# Altium project nRF52840_QI_Kernel.PrjPcb
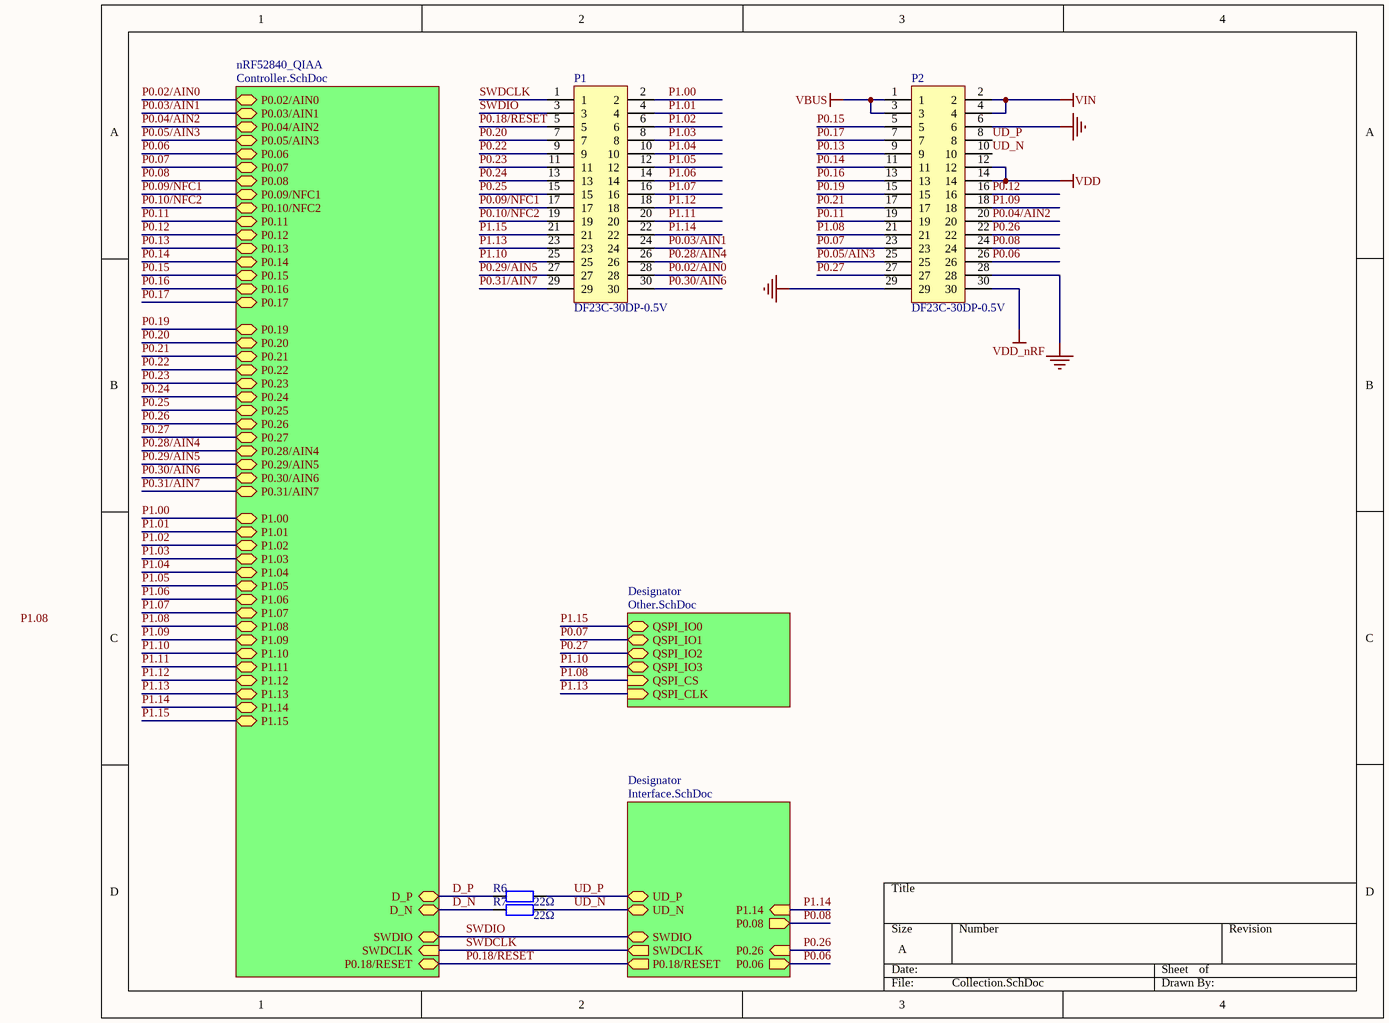
[diagram p0: Collection.SchDoc]
4 sheets, 79 parts. Net scope: hierarchical (ports join the sheet entries above them; power ports are global).
Board files: Main.PcbDoc, Main2.PcbDoc, Main4.PcbDoc
Sheets:
  Collection.SchDoc
    nRF52840_QIAA = Controller.SchDoc
    Designator = Interface.SchDoc
    Designator = Other.SchDoc

## Sheet Collection.SchDoc
size A; SheetNumber: 1; SheetTotal: 4

### Parts
P1  DF23C-30DP-0.5V  [DF23C-30DP-0.5V]
P2  DF23C-30DP-0.5V  [DF23C-30DP-0.5V]
R6  value 22Ω  [0402_R]  (hidden comment: 22Ω (22R0) ±1%)
R7  value 22Ω  [0402_R]  (hidden comment: 22Ω (22R0) ±1%)

### Sub-sheets
Designator = Interface.SchDoc: UD_P (bidir), UD_N (bidir), SWDCLK (out), SWDIO (bidir), P0.06 (out), P0.26 (in), P1.14 (in), P0.08 (out), P0.18/RESET (out)
Designator = Other.SchDoc: QSPI_IO0 (bidir), QSPI_IO1 (bidir), QSPI_IO2 (bidir), QSPI_IO3 (bidir), QSPI_CS (in), QSPI_CLK (in)
nRF52840_QIAA = Controller.SchDoc: P0.02/AIN0 (bidir), P0.03/AIN1 (bidir), P0.04/AIN2 (bidir), P0.05/AIN3 (bidir), P0.06 (bidir), P0.07 (bidir), P0.08 (bidir), D_P (bidir), D_N (bidir), P0.11 (bidir), P0.12 (bidir), P0.13 (bidir), P0.14 (bidir), P0.15 (bidir), P0.16 (bidir), P0.17 (bidir), P0.18/RESET (bidir), P0.19 (bidir), P0.20 (bidir), P0.21 (bidir), P0.22 (bidir), P0.23 (bidir), P0.24 (bidir), P0.25 (bidir), P0.26 (bidir), P0.27 (bidir), P0.28/AIN4 (bidir), P0.29/AIN5 (bidir), P0.30/AIN6 (bidir), P0.31/AIN7 (bidir), P1.00 (bidir), P1.01 (bidir), P1.02 (bidir), P1.03 (bidir), P1.04 (bidir), P1.05 (bidir), P1.06 (bidir), P1.07 (bidir), P1.08 (bidir), P1.09 (bidir), P1.10 (bidir), P1.11 (bidir), P1.12 (bidir), P1.13 (bidir), P1.14 (bidir), P1.15 (bidir), SWDCLK (in), SWDIO (bidir), P0.10/NFC2 (bidir), P0.09/NFC1 (bidir)

### Nets
GND: P2.6 P2.28 P2.29
VBUS: P2.1 P2.3
VDD: P2.12 P2.14
VDD_nRF: P2.30
VIN: P2.2 P2.4
D_N: R7.1 ; sheet nRF52840_QIAA/D_N
D_P: R6.1 ; sheet nRF52840_QIAA/D_P
P0.02/AIN0: P1.28 ; sheet nRF52840_QIAA/P0.02/AIN0
P0.03/AIN1: P1.24 ; sheet nRF52840_QIAA/P0.03/AIN1
P0.04/AIN2: P2.20 ; sheet nRF52840_QIAA/P0.04/AIN2
P0.05/AIN3: P2.25 ; sheet nRF52840_QIAA/P0.05/AIN3
P0.06: P2.26 ; sheet nRF52840_QIAA/P0.06, sheet Designator/P0.06
P0.07: P2.23 ; sheet nRF52840_QIAA/P0.07, sheet Designator/QSPI_IO1
P0.08: P2.24 ; sheet nRF52840_QIAA/P0.08, sheet Designator/P0.08
P0.09/NFC1: P1.17 ; sheet nRF52840_QIAA/P0.09/NFC1
P0.10/NFC2: P1.19 ; sheet nRF52840_QIAA/P0.10/NFC2
P0.11: P2.19 ; sheet nRF52840_QIAA/P0.11
P0.12: P2.16 ; sheet nRF52840_QIAA/P0.12
P0.13: P2.9 ; sheet nRF52840_QIAA/P0.13
P0.14: P2.11 ; sheet nRF52840_QIAA/P0.14
P0.15: P2.5 ; sheet nRF52840_QIAA/P0.15
P0.16: P2.13 ; sheet nRF52840_QIAA/P0.16
P0.17: P2.7 ; sheet nRF52840_QIAA/P0.17
P0.18/RESET: P1.5 ; sheet nRF52840_QIAA/P0.18/RESET, sheet Designator/P0.18/RESET
P0.19: P2.15 ; sheet nRF52840_QIAA/P0.19
P0.20: P1.7 ; sheet nRF52840_QIAA/P0.20
P0.21: P2.17 ; sheet nRF52840_QIAA/P0.21
P0.22: P1.9 ; sheet nRF52840_QIAA/P0.22
P0.23: P1.11 ; sheet nRF52840_QIAA/P0.23
P0.24: P1.13 ; sheet nRF52840_QIAA/P0.24
P0.25: P1.15 ; sheet nRF52840_QIAA/P0.25
P0.26: P2.22 ; sheet nRF52840_QIAA/P0.26, sheet Designator/P0.26
P0.27: P2.27 ; sheet nRF52840_QIAA/P0.27, sheet Designator/QSPI_IO2
P0.28/AIN4: P1.26 ; sheet nRF52840_QIAA/P0.28/AIN4
P0.29/AIN5: P1.27 ; sheet nRF52840_QIAA/P0.29/AIN5
P0.30/AIN6: P1.30 ; sheet nRF52840_QIAA/P0.30/AIN6
P0.31/AIN7: P1.29 ; sheet nRF52840_QIAA/P0.31/AIN7
P1.00: P1.2 ; sheet nRF52840_QIAA/P1.00
P1.01: P1.4 ; sheet nRF52840_QIAA/P1.01
P1.02: P1.6 ; sheet nRF52840_QIAA/P1.02
P1.03: P1.8 ; sheet nRF52840_QIAA/P1.03
P1.04: P1.10 ; sheet nRF52840_QIAA/P1.04
P1.05: P1.12 ; sheet nRF52840_QIAA/P1.05
P1.06: P1.14 ; sheet nRF52840_QIAA/P1.06
P1.07: P1.16 ; sheet nRF52840_QIAA/P1.07
P1.08: P2.21 ; sheet nRF52840_QIAA/P1.08, sheet Designator/QSPI_CS
P1.09: P2.18 ; sheet nRF52840_QIAA/P1.09
P1.10: P1.25 ; sheet nRF52840_QIAA/P1.10, sheet Designator/QSPI_IO3
P1.11: P1.20 ; sheet nRF52840_QIAA/P1.11
P1.12: P1.18 ; sheet nRF52840_QIAA/P1.12
P1.13: P1.23 ; sheet nRF52840_QIAA/P1.13, sheet Designator/QSPI_CLK
P1.14: P1.22 ; sheet nRF52840_QIAA/P1.14, sheet Designator/P1.14
P1.15: P1.21 ; sheet nRF52840_QIAA/P1.15, sheet Designator/QSPI_IO0
SWDCLK: P1.1 ; sheet nRF52840_QIAA/SWDCLK, sheet Designator/SWDCLK
SWDIO: P1.3 ; sheet nRF52840_QIAA/SWDIO, sheet Designator/SWDIO
UD_N: P2.10 R7.2 ; sheet Designator/UD_N
UD_P: P2.8 R6.2 ; sheet Designator/UD_P

### Notes on the sheet
- Labels drawn without touching a wire or pin: P1.08

### Library data of the parts
R6 R7 = 0402 22Ω (22R0) 1%: Chip Resistor

## Sheet Controller.SchDoc
size A; SheetNumber: 2; SheetTotal: 4
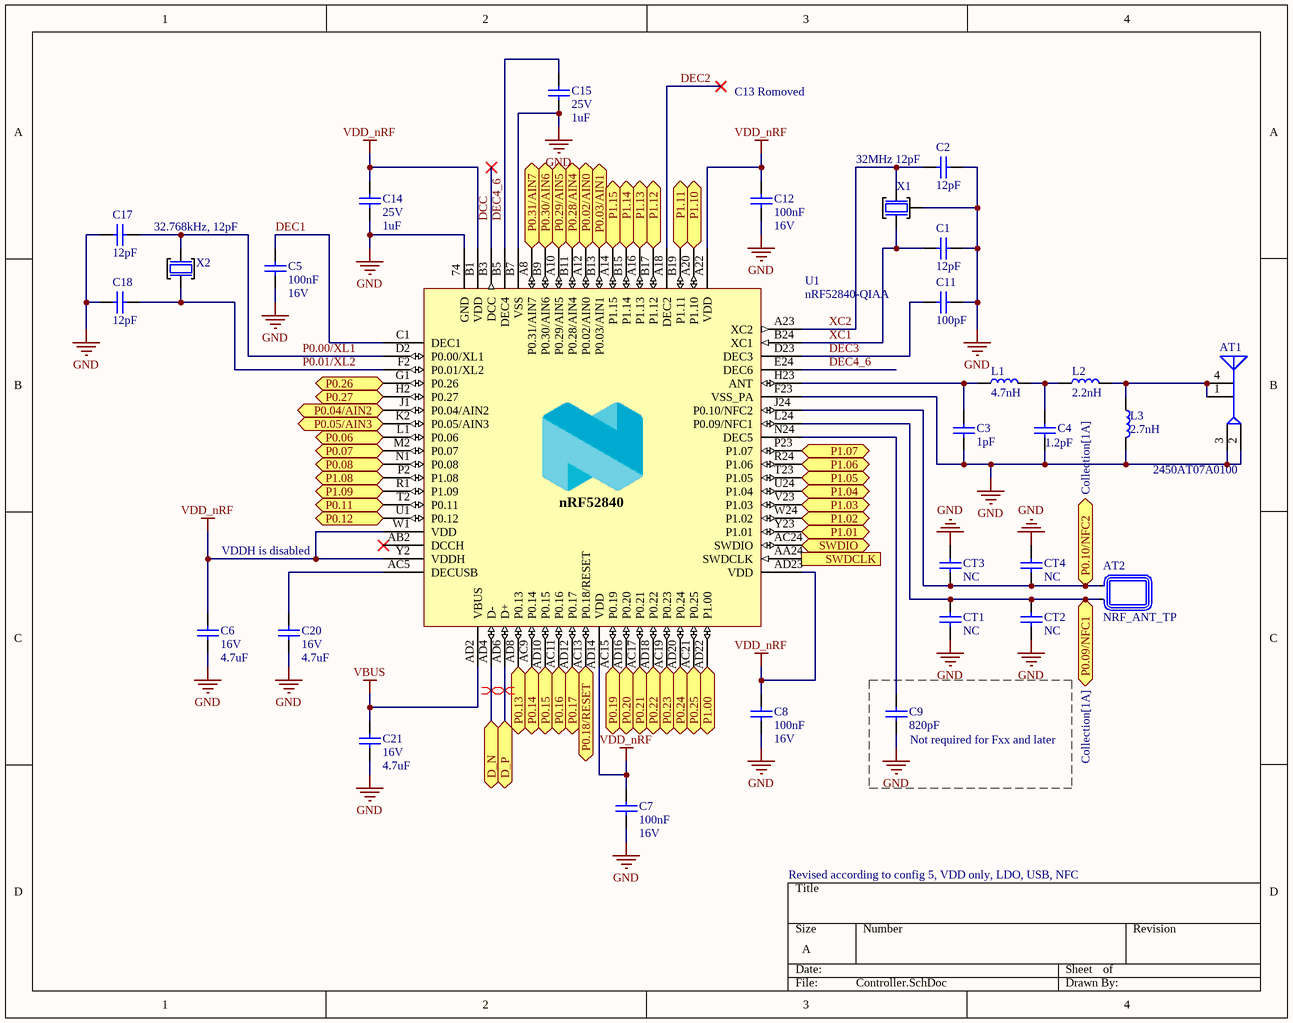
[diagram p1: Controller.SchDoc]

### Parts
AT1  2450AT07A0100  [2450AT07A0100-Footprint-1]
AT2  NRF_ANT_TP  [NRF_ANT_TP-Footprint-1]
C1  value 12pF  [0402_C]  (hidden comment: 12pF (120) 5% 50V)
C2  value 12pF  [0402_C]  (hidden comment: 12pF (120) 5% 50V)
C3  value 1pF  [0402_C]  (hidden comment: 1pF (1R0) 0.25pF 50V)
C4  value 1.2pF  [0402_C]  (hidden comment: 1.2pF (1R2) 50V)
C5  value 100nF  Voltage: 16V  [0402_C]  (hidden comment: 100nF (104) 10% 16V)
C6  value 4.7uF  Voltage: 16V  [0603_C]  (hidden comment: 4.7uF (475) 10% 16V)
C7  value 100nF  Voltage: 16V  [0402_C]  (hidden comment: 100nF (104) 10% 16V)
C8  value 100nF  Voltage: 16V  [0402_C]  (hidden comment: 100nF (104) 10% 16V)
C9  value 820pF  [0402_C]  (hidden comment: 820pF (821) 10% 50V)
C11  value 100pF  [0402_C]  (hidden comment: 100pF (101) 5% 50V)
C12  value 100nF  Voltage: 16V  [0402_C]  (hidden comment: 100nF (104) 10% 16V)
C14  value 1uF  Voltage: 25V  [0402_C]  (hidden comment: 1uF (105) 10% 25V)
C15  value 1uF  Voltage: 25V  [0402_C]  (hidden comment: 1uF (105) 10% 25V)
C17  value 12pF  [0402_C]  (hidden comment: 12pF (120) 5% 50V)
C18  value 12pF  [0402_C]  (hidden comment: 12pF (120) 5% 50V)
C20  value 4.7uF  Voltage: 16V  [0603_C]  (hidden comment: 4.7uF (475) 10% 16V)
C21  value 4.7uF  Voltage: 16V  [0603_C]  (hidden comment: 4.7uF (475) 10% 16V)
CT1  NC  [0402_C]
CT2  NC  [0402_C]
CT3  NC  [0402_C]
CT4  NC  [0402_C]
L1  4.7nH  [0402_L]
L2  2.2nH  [0402_L]
L3  2.7nH  [0402_L]
U1  nRF52840-QIAA  [AQFN50P700X700X85_HS-74N]
X1  32MHz 12pF  [XTAL_2016_4P]
X2  32.768kHz, 12pF  [XTAL_2012_2P]

### Blocks framed on the sheet
Not required for Fxx and later: C9

### Ports
D_N (bidir, see Collection[2D]), D_P (bidir, see Collection[2D]), P0.02/AIN0 (bidir, see Collection[1A]), P0.03/AIN1 (bidir, see Collection[1A]), P0.04/AIN2 (bidir, see Collection[1A]), P0.05/AIN3 (bidir, see Collection[1A]), P0.06 (bidir, see Collection[1A], Interface[4C]), P0.07 (bidir, see Collection[1A]), P0.08 (bidir, see Collection[1A], Interface[2C]), P0.09/NFC1 (bidir, see Collection[1A]), P0.10/NFC2 (bidir, see Collection[1A]), P0.11 (bidir, see Collection[1A]), P0.12 (bidir, see Collection[1A]), P0.13 (bidir, see Collection[1A]), P0.14 (bidir, see Collection[1B]), P0.15 (bidir, see Collection[1B]), P0.16 (bidir, see Collection[1B]), P0.17 (bidir, see Collection[1B]), P0.18/RESET (bidir, see Collection[2D], Interface[1D]), P0.19 (bidir, see Collection[1B]), P0.20 (bidir, see Collection[1B]), P0.21 (bidir, see Collection[1B]), P0.22 (bidir, see Collection[1B]), P0.23 (bidir, see Collection[1B]), P0.24 (bidir, see Collection[1B]), P0.25 (bidir, see Collection[1B]), P0.26 (bidir, see Collection[1B], Interface[4C]), P0.27 (bidir, see Collection[1B]), P0.28/AIN4 (bidir, see Collection[1B]), P0.29/AIN5 (bidir, see Collection[1B]), P0.30/AIN6 (bidir, see Collection[1B]), P0.31/AIN7 (bidir, see Collection[1B]), P1.00 (bidir, see Collection[1C]), P1.01 (bidir, see Collection[1C]), P1.02 (bidir, see Collection[1C]), P1.03 (bidir, see Collection[1C]), P1.04 (bidir, see Collection[1C]), P1.05 (bidir, see Collection[1C]), P1.06 (bidir, see Collection[1C]), P1.07 (bidir, see Collection[1C]), P1.08 (bidir, see Collection[1C]), P1.09 (bidir, see Collection[1C]), P1.10 (bidir, see Collection[1C]), P1.11 (bidir, see Collection[1C]), P1.12 (bidir, see Collection[1C]), P1.13 (bidir, see Collection[1C]), P1.14 (bidir, see Collection[1C], Interface[2D]), P1.15 (bidir, see Collection[1C]), SWDCLK (in, see Collection[2D], Interface[4C]), SWDIO (bidir, see Collection[2D], Interface[4C])

### Nets
GND: AT1.2 AT1.3 C1.2 C2.2 C3.1 C4.1 C5.1 C6.1 C7.1 C8.1 C9.1 C11.2 C12.1 C14.1 C15.1 C17.1 C18.1 C20.1 C21.1 CT1.1 CT2.1 CT3.2 CT4.2 L3.2 U1.74(GND) U1.B7(VSS) U1.F23(VSS_PA) X1.2(GND)
VBUS: C21.2 U1.AD2(VBUS)
VDD_nRF: C6.2 C7.2 C8.2 C12.2 C14.2 U1.A22(VDD) U1.AD14(VDD) U1.AD23(VDD) U1.B1(VDD) U1.W1(VDD) U1.Y2(VDDH)
D_N: U1.AD4(D-) ; port D_N
D_P: U1.AD6(D+) ; port D_P
DCC: U1.B3(DCC)
DEC1: C5.2 U1.C1(DEC1)
DEC2: U1.A18(DEC2)
DEC3: C11.1 U1.D23(DEC3)
DEC4_6: C15.2 U1.B5(DEC4) U1.E24(DEC6)
P0.00/XL1: C17.2 U1.D2(P0.00/XL1) X2.2(OUT)
P0.01/XL2: C18.2 U1.F2(P0.01/XL2) X2.1(IN)
P0.02/AIN0: U1.A12(P0.02/AIN0) ; port P0.02/AIN0
P0.03/AIN1: U1.B13(P0.03/AIN1) ; port P0.03/AIN1
P0.04/AIN2: U1.J1(P0.04/AIN2) ; port P0.04/AIN2
P0.05/AIN3: U1.K2(P0.05/AIN3) ; port P0.05/AIN3
P0.06: U1.L1(P0.06) ; port P0.06
P0.07: U1.M2(P0.07) ; port P0.07
P0.08: U1.N1(P0.08) ; port P0.08
P0.09/NFC1: AT2.2 CT1.2 CT2.2 U1.L24(P0.09/NFC1) ; port P0.09/NFC1
P0.10/NFC2: AT2.1 CT3.1 CT4.1 U1.J24(P0.10/NFC2) ; port P0.10/NFC2
P0.11: U1.T2(P0.11) ; port P0.11
P0.12: U1.U1(P0.12) ; port P0.12
P0.13: U1.AD8(P0.13) ; port P0.13
P0.14: U1.AC9(P0.14) ; port P0.14
P0.15: U1.AD10(P0.15) ; port P0.15
P0.16: U1.AC11(P0.16) ; port P0.16
P0.17: U1.AD12(P0.17) ; port P0.17
P0.18/RESET: U1.AC13(P0.18/RESET) ; port P0.18/RESET
P0.19: U1.AC15(P0.19) ; port P0.19
P0.20: U1.AD16(P0.20) ; port P0.20
P0.21: U1.AC17(P0.21) ; port P0.21
P0.22: U1.AD18(P0.22) ; port P0.22
P0.23: U1.AC19(P0.23) ; port P0.23
P0.24: U1.AD20(P0.24) ; port P0.24
P0.25: U1.AC21(P0.25) ; port P0.25
P0.26: U1.G1(P0.26) ; port P0.26
P0.27: U1.H2(P0.27) ; port P0.27
P0.28/AIN4: U1.B11(P0.28/AIN4) ; port P0.28/AIN4
P0.29/AIN5: U1.A10(P0.29/AIN5) ; port P0.29/AIN5
P0.30/AIN6: U1.B9(P0.30/AIN6) ; port P0.30/AIN6
P0.31/AIN7: U1.A8(P0.31/AIN7) ; port P0.31/AIN7
P1.00: U1.AD22(P1.00) ; port P1.00
P1.01: U1.Y23(P1.01) ; port P1.01
P1.02: U1.W24(P1.02) ; port P1.02
P1.03: U1.V23(P1.03) ; port P1.03
P1.04: U1.U24(P1.04) ; port P1.04
P1.05: U1.T23(P1.05) ; port P1.05
P1.06: U1.R24(P1.06) ; port P1.06
P1.07: U1.P23(P1.07) ; port P1.07
P1.08: U1.P2(P1.08) ; port P1.08
P1.09: U1.R1(P1.09) ; port P1.09
P1.10: U1.A20(P1.10) ; port P1.10
P1.11: U1.B19(P1.11) ; port P1.11
P1.12: U1.B17(P1.12) ; port P1.12
P1.13: U1.A16(P1.13) ; port P1.13
P1.14: U1.B15(P1.14) ; port P1.14
P1.15: U1.A14(P1.15) ; port P1.15
SWDCLK: U1.AA24(SWDCLK) ; port SWDCLK
SWDIO: U1.AC24(SWDIO) ; port SWDIO
XC1: C1.1 U1.B24(XC1) X1.1(IN)
XC2: C2.1 U1.A23(XC2) X1.3(OUT)
NetAT1_1: AT1.1 AT1.4 L2.2 L3.1
NetC3_2: C3.2 L1.1 U1.H23(ANT)
NetC4_2: C4.2 L1.2 L2.1
NetC9_2: C9.2 U1.N24(DEC5)
NetC20_2: C20.2 U1.AC5(DECUSB)

Not connected (* = marked no-connect by the designer): U1 AB2(DCCH)*

### Layout directives
differential pair: D_N, D_P

### Notes on the sheet
- C13 Romoved
- VDDH is disabled
- Revised according to config 5, VDD only, LDO, USB, NFC
- (in symbol nRF52840-QIAA) nRF52840

### Library data of the parts
AT1 = CMP-00025-00003-1: 2.4GHz Chip RF Antenna 2.4GHz ~ 2.5GHz 1dBi Solder Surface Mount; Impedance: 50Ω; Max Operating Temperature: 125°C; Frequency: 2.4GHz; Pins: 4; RoHS Compliant: Yes; Min Operating Temperature: -40°C; Mounting Technology: SMD
AT2 = CMP-00025-00004-1: NRF Antenna Testpoint; Pins: 2
C1 C2 C17 C18 = 0402 12pF (120) 5% 50V: Chip Capacitor; Package: 0402; Voltage: 50V
C3 = 0402 1pF (1R0) 0.25pF 50V: Chip Capacitor; Voltage: 50V
C4 = 0402 1.2pF (1R2) 50V: Chip Capacitor; Voltage: 50V
C5 C7 C8 C12 = 0402 100nF (104) 10% 16V: Chip Capacitor
C6 C20 C21 = 0603 4.7uF (475) 10% 16V: Chip Capacitor; ComponentLink1Description: 供应商链接; ComponentLink1URL: http://www.szlcsc.com/product/details_20375.html; Package: 0603
C9 = 0402 820pF (821) 10% 50V: Chip Capacitor; Voltage: 50V
C11 = 0402 100pF (101) 5% 50V: Chip Capacitor; Voltage: 50V
C14 C15 = 0402 1uF (105) 10% 25V: Chip Capacitor
CT1-CT4 = 0402 Capacitor Testpoint: Chip Capacitor Testpoint; Value: NC
L1 = 0402 4.7nH 0.3nH: Chip Inductor; ComponentLink1Description: 供应商链接; ComponentLink1URL: http://www.szlcsc.com/product/details_14246.html; Value: 4.7nH
L2 = 0402 2.2nH: Chip Inductor; Value: 2.2nH
L3 = 0402 2.7nH 0.3nH: Chip Inductor; Value: 2.7nH
U1 = nRF52840-QIAA: Multi-protocol Bluetooth Low Energy, IEEE 802.15.4, ANT and 2.4GHz proprietary system-on-chip; Pad Count: 73; Part Number: nRF52840-QIAA; LatestRevisionDate: 2017-08-21; Published: 2017-08-21; Value: nRF52840-QIAA; Footprint Doc: AQFN-73
X1 = XTAL_SMD2016_32MHz_12pF: XTAL SMD 2016, 32MHz, Cl=12pF, Total Tol: ±20ppm; Frequency: 32MHz; Pins: 4
X2 = XTAL_SMD2012_32.768kHz_12pF: 32.768kHz 12pF ±20ppm SMD2012-2P  Crystals ROHS; Pad Count: 2; Frequency: 32.768kHz; Component Class: Oscillators

## Sheet Interface.SchDoc
size A; SheetNumber: 3; SheetTotal: 4
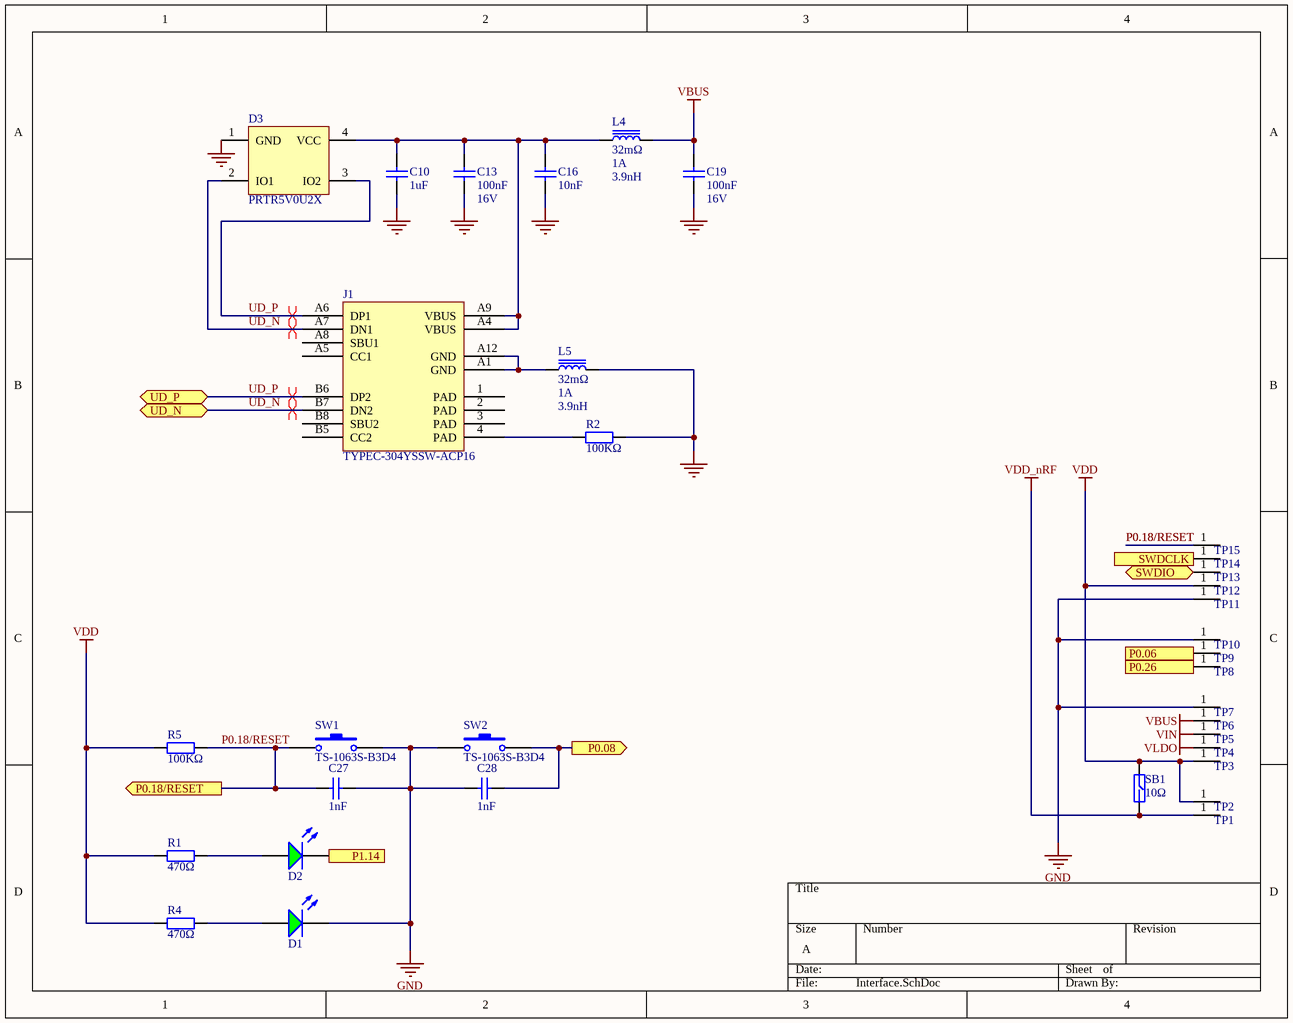
[diagram p2: Interface.SchDoc]

### Parts
C10  value 1uF  [0603_C]  (hidden comment: 1uF (105) 10% 50V)
C13  value 100nF  Voltage: 16V  [0402_C]  (hidden comment: 100nF (104) 10% 16V)
C16  value 10nF  [0402_C]  (hidden comment: 10nF (103) 10% 50V)
C19  value 100nF  Voltage: 16V  [0402_C]  (hidden comment: 100nF (104) 10% 16V)
C27  value 1nF  [0402_C]  (hidden comment: 1nF (102) 10% 50V)
C28  value 1nF  [0402_C]  (hidden comment: 1nF (102) 10% 50V)
D1  0603 LED Green  [0603_LED_S1]  (value not drawn)
D2  0603 LED Green  [0603_LED_S1]  (value not drawn)
D3  PRTR5V0U2X  [SOT190P230X110-4L]
J1  TYPEC-304YSSW-ACP16  [TYPEC-304YSSW-ACP16]
L4  value 3.9nH  DC Resistance: 32mΩ  Current: 1A  [0603_L]  (hidden comment: LQW18AN3N9C10D)
L5  value 3.9nH  DC Resistance: 32mΩ  Current: 1A  [0603_L]  (hidden comment: LQW18AN3N9C10D)
R1  value 470Ω  [0402_R]  (hidden comment: 470Ω (4700) ±1%)
R2  value 100KΩ  [0402_R]  (hidden comment: 100KΩ (1003) ±1%)
R4  value 470Ω  [0402_R]  (hidden comment: 470Ω (4700) ±1%)
R5  value 100KΩ  [0402_R]  (hidden comment: 100KΩ (1003) ±1%)
SB1  10Ω  [0603-FUSE]
SW1  TS-1063S-B3D4  [TS-1063S-B3D4]
SW2  TS-1063S-B3D4  [TS-1063S-B3D4]
TP1  Test Point  [TP_H_24_80_36]  (value not drawn)  (net tie, no BOM)
TP2  Test Point  [TP_H_24_80_36]  (value not drawn)  (net tie, no BOM)
TP3  Test Point  [TP_H_24_80_36]  (value not drawn)  (net tie, no BOM)
TP4  Test Point  [TP_H_24_80_36]  (value not drawn)  (net tie, no BOM)
TP5  Test Point  [TP_H_24_80_36]  (value not drawn)  (net tie, no BOM)
TP6  Test Point  [TP_H_24_80_36]  (value not drawn)  (net tie, no BOM)
TP7  Test Point  [TP_H_24_80_36]  (value not drawn)  (net tie, no BOM)
TP8  Test Point  [TP_H_24_80_36]  (value not drawn)  (net tie, no BOM)
TP9  Test Point  [TP_H_24_80_36]  (value not drawn)  (net tie, no BOM)
TP10  Test Point  [TP_H_24_80_36]  (value not drawn)  (net tie, no BOM)
TP11  Test Point  [TP_H_24_80_36]  (value not drawn)  (net tie, no BOM)
TP12  Test Point  [TP_H_24_80_36]  (value not drawn)  (net tie, no BOM)
TP13  Test Point  [TP_H_24_80_36]  (value not drawn)  (net tie, no BOM)
TP14  Test Point  [TP_H_24_80_36]  (value not drawn)  (net tie, no BOM)
TP15  Test Point  [TP_H_24_80_36]  (value not drawn)  (net tie, no BOM)

### Ports
P0.06 (out, see Collection[3D], Controller[1B]), P0.08 (out, see Collection[3D], Controller[1B]), P0.18/RESET (out, see Collection[2D], Controller[2C]), P0.26 (in, see Collection[3D], Controller[1B]), P1.14 (in, see Collection[3D], Controller[2A]), SWDCLK (out, see Collection[2D], Controller[3C]), SWDIO (bidir, see Collection[2D], Controller[3C]), UD_N (bidir, see Collection[2D]), UD_P (bidir, see Collection[2D])

### Nets
GND: C10.1 C13.1 C16.1 C19.1 C27.2 C28.1 D1.K D3.1(GND) L5.2 R2.2 SW1.2 SW2.1 TP7.1(TP) TP10.1(TP) TP11.1(TP)
VBUS: C19.2 L4.2 TP6.1(TP)
VDD: R1.1 R4.1 R5.1 SB1.1 TP2.1(TP) TP3.1(TP) TP12.1(TP)
VDD_nRF: SB1.2 TP1.1(TP)
VIN: TP5.1(TP)
VLDO: TP4.1(TP)
P0.06: TP9.1(TP) ; port P0.06
P0.08: C28.2 SW2.2 ; port P0.08
P0.18/RESET: C27.1 R5.2 SW1.1 TP15.1(TP) ; port P0.18/RESET
P0.26: TP8.1(TP) ; port P0.26
P1.14: D2.K ; port P1.14
SWDCLK: TP14.1(TP) ; port SWDCLK
SWDIO: TP13.1(TP) ; port SWDIO
UD_N: D3.2(IO1) J1.A7(DN1) J1.B7(DN2) ; port UD_N
UD_P: D3.3(IO2) J1.A6(DP1) J1.B6(DP2) ; port UD_P
NetC10_2: C10.2 C13.2 C16.2 D3.4(VCC) J1.A4(VBUS) J1.A9(VBUS) L4.1
NetD1_A: D1.A R4.2
NetD2_A: D2.A R1.2
NetJ1_4: J1.4(PAD) R2.1
NetJ1_A1: J1.A1(GND) J1.A12(GND) L5.1

Not connected (* = marked no-connect by the designer): J1 1(PAD) 2(PAD) 3(PAD) A5(CC1) A8(SBU1) B5(CC2) B8(SBU2)

### Layout directives
differential pair: UD_N, UD_P

### Library data of the parts
C10 = 0603 1uF (105) 10% 50V: Chip Capacitor; Package: 0603; Voltage: 50V
C13 C19 = 0402 100nF (104) 10% 16V: Chip Capacitor
C16 = 0402 10nF (103) 10% 50V: Chip Capacitor; Package: 0402; Voltage: 50V
C27 C28 = 0402 1nF (102) 10% 50V: Chip Capacitor; Voltage: 50V
D1 D2 = 0603 LED Green: Green LED; Package: 0603; Color: Green
D3 = PRTR5V0U2X: Ultra low capacitance double rail-to-rail ESD protection diode; Manufacturer: NXP Semiconductors; Part number IPS: 00000009951; Note: N.A.; Artikkelnr Noca: 10069015; Pad Count: 4; Part Number: PRTR5V0U2X; Manufacturer Part Number: PRTR5V0U2X; LatestRevisionDate: 2017-11-09; Publisher: Nordic Semiconductor; Published: 2012-06-11; Value: PRTR5V0U2X; Footprint Doc: SOT-143B; ComponentLink1URL: N.A.; ComponentLink1Description: Datasheet; ComponentLink2URL: N.A.; ComponentLink2Description: Supplier link; HelpURL: http://www.farnell.com/datasheets/109718.pdf; Pin Count: 4; Supplier 1: Digi-Key; Supplier Part Number 1: 568-4140-1-ND; Supplier 2: Farnell; Supplier Part Number 2: 152-4157; Author: rsk; Component Class: Semiconductors; PartId: 101300082; Part number Norautron: N.A.
J1 = TYPEC-304YSSW-ACP16: 5A16PIN TYPEC
L4 L5 = LQW18AN3N9C10D: 1A 3.9nH 32mΩ 0603  Inductors (SMD) ROHS; Package: 0603
R1 R4 = 0402 470Ω (4700) 1%: Chip Resistor; Package: 0402
R2 R5 = 0402 100KΩ (1003) 1%: Chip Resistor; Package: 0402
SB1 = Test-Fuse: Fuse easy soldering for test, with 10Ω 0603 Resistor soldered
SW1 SW2 = TS-1063S-B3D4: SPST 250gf@±30gf -  Tactile Switches ROHS
TP1-TP15 = Test-Point

## Sheet Other.SchDoc
size A; SheetNumber: 4; SheetTotal: 4
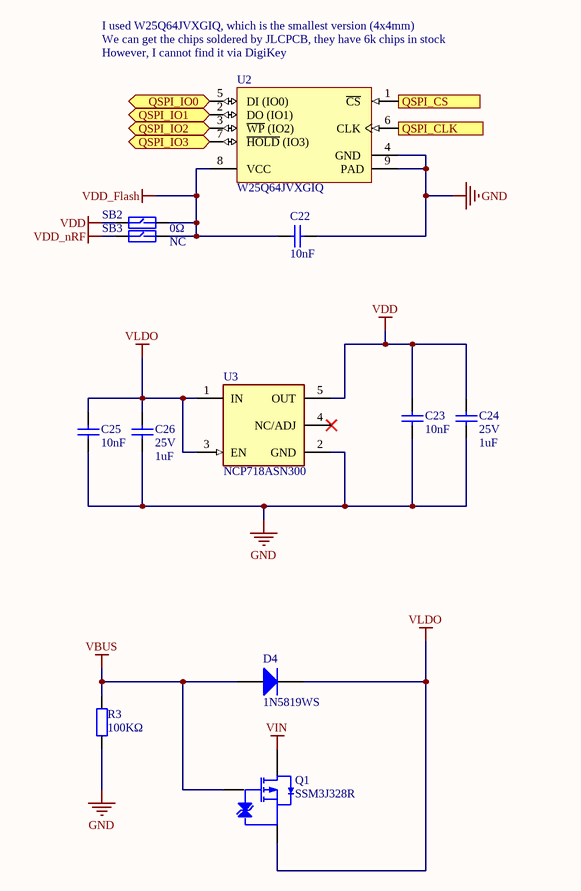
[diagram p3: Other.SchDoc]

### Parts
C22  value 10nF  [0402_C]  (hidden comment: 10nF (103) 10% 50V)
C23  value 10nF  [0402_C]  (hidden comment: 10nF (103) 10% 50V)
C24  value 1uF  Voltage: 25V  [0402_C]  (hidden comment: 1uF (105) 10% 25V)
C25  value 10nF  [0402_C]  (hidden comment: 10nF (103) 10% 50V)
C26  value 1uF  Voltage: 25V  [0402_C]  (hidden comment: 1uF (105) 10% 25V)
D4  1N5819WS  [SOD-323]
Q1  SSM3J328R  [SOT-23-3L]
R3  value 100KΩ  [0402_R]  (hidden comment: 100KΩ (1003) ±1%)
SB2  0Ω  [0603-FUSE]
SB3  NC  [0603-FUSE]
U2  W25Q64JVXGIQ  [W25Qxx-xSON127P600-8N]
U3  NCP718ASN300  [SOT-23-5L]

### Ports
QSPI_CLK (in, see Collection[2C]), QSPI_CS (in, see Collection[2C]), QSPI_IO0 (bidir, see Collection[2C]), QSPI_IO1 (bidir, see Collection[2C]), QSPI_IO2 (bidir, see Collection[2C]), QSPI_IO3 (bidir, see Collection[2C])

### Nets
GND: C22.2 C23.1 C24.1 C25.1 C26.1 R3.1 U2.4(GND) U2.9(PAD) U3.2(GND)
VBUS: D4.1(A) Q1.1(G) R3.2
VDD: C23.2 C24.2 SB2.1 U3.5(OUT)
VDD_Flash: C22.1 SB2.2 SB3.2 U2.8(VCC)
VDD_nRF: SB3.1
VIN: Q1.3(D)
VLDO: C25.2 C26.2 D4.2(K) Q1.2(S) U3.1(IN) U3.3(EN)
P0.07: U2.2(DO_(IO1)) ; port QSPI_IO1
P0.27: U2.3(~{WP}_(IO2)) ; port QSPI_IO2
P1.08: U2.1(~{CS}) ; port QSPI_CS
P1.10: U2.7(~{HOLD}_(IO3)) ; port QSPI_IO3
P1.13: U2.6(CLK) ; port QSPI_CLK
P1.15: U2.5(DI_(IO0)) ; port QSPI_IO0

Not connected (* = marked no-connect by the designer): U3 4(NC/ADJ)*

### Notes on the sheet
- I used W25Q64JVXGIQ, which is the smallest version (4x4mm)
- We can get the chips soldered by JLCPCB, they have 6k chips in stock
- (near U2) However, I cannot find it via DigiKey

### Library data of the parts
C22 C23 C25 = 0402 10nF (103) 10% 50V: Chip Capacitor; Package: 0402; Voltage: 50V
C24 C26 = 0402 1uF (105) 10% 25V: Chip Capacitor
D4 = 1N5819WS: Maximum Average Forward Rectified Current: 1A; Maximum Forward Voltage: 1V; JLCPCB Part Number: C191023; ComponentLink1Description: Datasheet; ComponentLink1URL: https://datasheet.lcsc.com/lcsc/2204281430_Guangdong-Hottech-1N5819WS_C191023.pdf
Q1 = SSM3J328R: 20V 6A 29.8mΩ@4.5V,3A 1W P Channel SOT-23(TO-236)  MOSFETs ROHS; ComponentLink1Description: 供应商链接; ComponentLink1URL: http://www.szlcsc.com/product/details_15801.html; Package: SOT-23F; Supplier: LC; SuppliersPartNumber: C15127
R3 = 0402 100KΩ (1003) 1%: Chip Resistor; Package: 0402
SB2 SB3 = Test-Fuse: Fuse easy soldering for test
U2 = W25Q64JVXGIQ: 3V 64M-Bit Serial Flash Memory with Dual/Quad SPI & QPI, 2.7 to 3.6 V, -40 to 85 degC, 8-Pin XSON, RoHS, Tape and Reel; Manufacturer: Winbond; Manufacturer Part Number: W25Q64FVSSIG; Boot Type: Bottom/Top; Word Size: 8b; Cell Type: NOR; Operating Supply Voltage (Min): 2.7V; Operating Supply Voltage (Max): 3.6V; Rad Hardened: No; Density: 67108864Bit; Address Bus: 1b; Supply Current: 40mA; Sync/Async: Synchronous; Number of Words: 8M; Programmable: Yes; Operating Supply Voltage (Typ): 3/3.3V; Access Time (Max): 8.5ns; Interface Type: Serial(SPI); Operating Temperature Classification: Industrial; Datasheet Version: Rev. D, 12/2011; Operating Temp Range: -40Cto85C; Operating Temperature (Max): 85C; Pin Count: 8; Mounting: SurfaceMount; Program/Erase Volt (Typ): 2.7to3.6V; Operating Temperature (Min): -40C; Package Description: 8-Pin Small Outline Integrated Circuit, Body 5.28 x 5.28 mm, Pitch 1.27 mm; Datasheet URL: https://datasheet.ciiva.com/15126/getdatasheetpartid-552937-15126648.pdf; Package Reference: SS-8; Manufacturer URL: http://www.winbond.com/hq/index.html?__locale=en; Package Type: SOIC
U3 = NCP718ASN300: 3V LDO 300 MA LOW IQ WIDE INPUT; Manufacturer Part Number: NCP718BSNADJT1G; Manufacturer: On Semiconductor; Max Supply Voltage: 24V; Output Type: AdjustableProgrammable; Min Supply Voltage: 2.5V; Max Junction Temp: +125°C; Nominal Supply Current: 50-300uA; Dropout Voltage: 480mV; Accuracy Percentage: 2%; Standoff Height: 0.01mm; Output Voltage: 1.2-5V; Number Of Outputs: 1; Output Current: 300mA; Lead Free: Yes; Temperature: to +125°C; ComponentLink2URL: https://www.onsemi.com/pub/Collateral/NCP718-D.PDF; Height: 1mm; ComponentLink2Description: Datasheet; Octopart: https://octopart.com/ncp718bsnadjt1g-on+semiconductor-87658781; Device Class L1: Integrated Circuits (ICs); Device Class L2: Power Management ICs; Device Class L3: Voltage Regulators - Linear; Digikey Description: 300 MA LOW IQ WIDE INPUT; Temperature Range High: +125°C; Package: 419AE-01; Mouser Description: LDO Regulator, 300 mA, Wide Vin, Ultra-Low Iq Adjustable, Non-Active Discharge, TSOT23-5; Category: IC; Automotive: No; RoHS: TRUE; Manufacturer: ON Semiconductor

## Nets that join several sheets
GND: Collection (P2.6 P2.28 P2.29), Controller (28 pins), Interface (15 pins), Other (9 pins)
VBUS: Collection (P2.1 P2.3), Controller (C21.2 U1.AD2), Interface (C19.2 L4.2 TP6.1), Other (D4.1 Q1.1 R3.2)
VDD: Collection (P2.12 P2.14), Interface (7 pins), Other (C23.2 C24.2 SB2.1 U3.5)
VDD_nRF: Collection (P2.30), Controller (11 pins), Interface (SB1.2 TP1.1), Other (SB3.1)
VIN: Collection (P2.2 P2.4), Interface (TP5.1), Other (Q1.3)
VLDO: Interface (TP4.1), Other (6 pins)
D_N: Collection (R7.1), Controller (U1.AD4)
D_P: Collection (R6.1), Controller (U1.AD6)
P0.02/AIN0: Collection (P1.28), Controller (U1.A12)
P0.03/AIN1: Collection (P1.24), Controller (U1.B13)
P0.04/AIN2: Collection (P2.20), Controller (U1.J1)
P0.05/AIN3: Collection (P2.25), Controller (U1.K2)
P0.06: Collection (P2.26), Controller (U1.L1), Interface (TP9.1)
P0.07: Collection (P2.23), Controller (U1.M2), Other (U2.2)
P0.08: Collection (P2.24), Controller (U1.N1), Interface (C28.2 SW2.2)
P0.09/NFC1: Collection (P1.17), Controller (AT2.2 CT1.2 CT2.2 U1.L24)
P0.10/NFC2: Collection (P1.19), Controller (AT2.1 CT3.1 CT4.1 U1.J24)
P0.11: Collection (P2.19), Controller (U1.T2)
P0.12: Collection (P2.16), Controller (U1.U1)
P0.13: Collection (P2.9), Controller (U1.AD8)
P0.14: Collection (P2.11), Controller (U1.AC9)
P0.15: Collection (P2.5), Controller (U1.AD10)
P0.16: Collection (P2.13), Controller (U1.AC11)
P0.17: Collection (P2.7), Controller (U1.AD12)
P0.18/RESET: Collection (P1.5), Controller (U1.AC13), Interface (C27.1 R5.2 SW1.1 TP15.1)
P0.19: Collection (P2.15), Controller (U1.AC15)
P0.20: Collection (P1.7), Controller (U1.AD16)
P0.21: Collection (P2.17), Controller (U1.AC17)
P0.22: Collection (P1.9), Controller (U1.AD18)
P0.23: Collection (P1.11), Controller (U1.AC19)
P0.24: Collection (P1.13), Controller (U1.AD20)
P0.25: Collection (P1.15), Controller (U1.AC21)
P0.26: Collection (P2.22), Controller (U1.G1), Interface (TP8.1)
P0.27: Collection (P2.27), Controller (U1.H2), Other (U2.3)
P0.28/AIN4: Collection (P1.26), Controller (U1.B11)
P0.29/AIN5: Collection (P1.27), Controller (U1.A10)
P0.30/AIN6: Collection (P1.30), Controller (U1.B9)
P0.31/AIN7: Collection (P1.29), Controller (U1.A8)
P1.00: Collection (P1.2), Controller (U1.AD22)
P1.01: Collection (P1.4), Controller (U1.Y23)
P1.02: Collection (P1.6), Controller (U1.W24)
P1.03: Collection (P1.8), Controller (U1.V23)
P1.04: Collection (P1.10), Controller (U1.U24)
P1.05: Collection (P1.12), Controller (U1.T23)
P1.06: Collection (P1.14), Controller (U1.R24)
P1.07: Collection (P1.16), Controller (U1.P23)
P1.08: Collection (P2.21), Controller (U1.P2), Other (U2.1)
P1.09: Collection (P2.18), Controller (U1.R1)
P1.10: Collection (P1.25), Controller (U1.A20), Other (U2.7)
P1.11: Collection (P1.20), Controller (U1.B19)
P1.12: Collection (P1.18), Controller (U1.B17)
P1.13: Collection (P1.23), Controller (U1.A16), Other (U2.6)
P1.14: Collection (P1.22), Controller (U1.B15), Interface (D2.K)
P1.15: Collection (P1.21), Controller (U1.A14), Other (U2.5)
SWDCLK: Collection (P1.1), Controller (U1.AA24), Interface (TP14.1)
SWDIO: Collection (P1.3), Controller (U1.AC24), Interface (TP13.1)
UD_N: Collection (P2.10 R7.2), Interface (D3.2 J1.A7 J1.B7)
UD_P: Collection (P2.8 R6.2), Interface (D3.3 J1.A6 J1.B6)